# EAGLE schematic Fuel_Cell_Controller_may2022 (EAGLE 9.6.2)

## Sheet 1 of 9: MCU
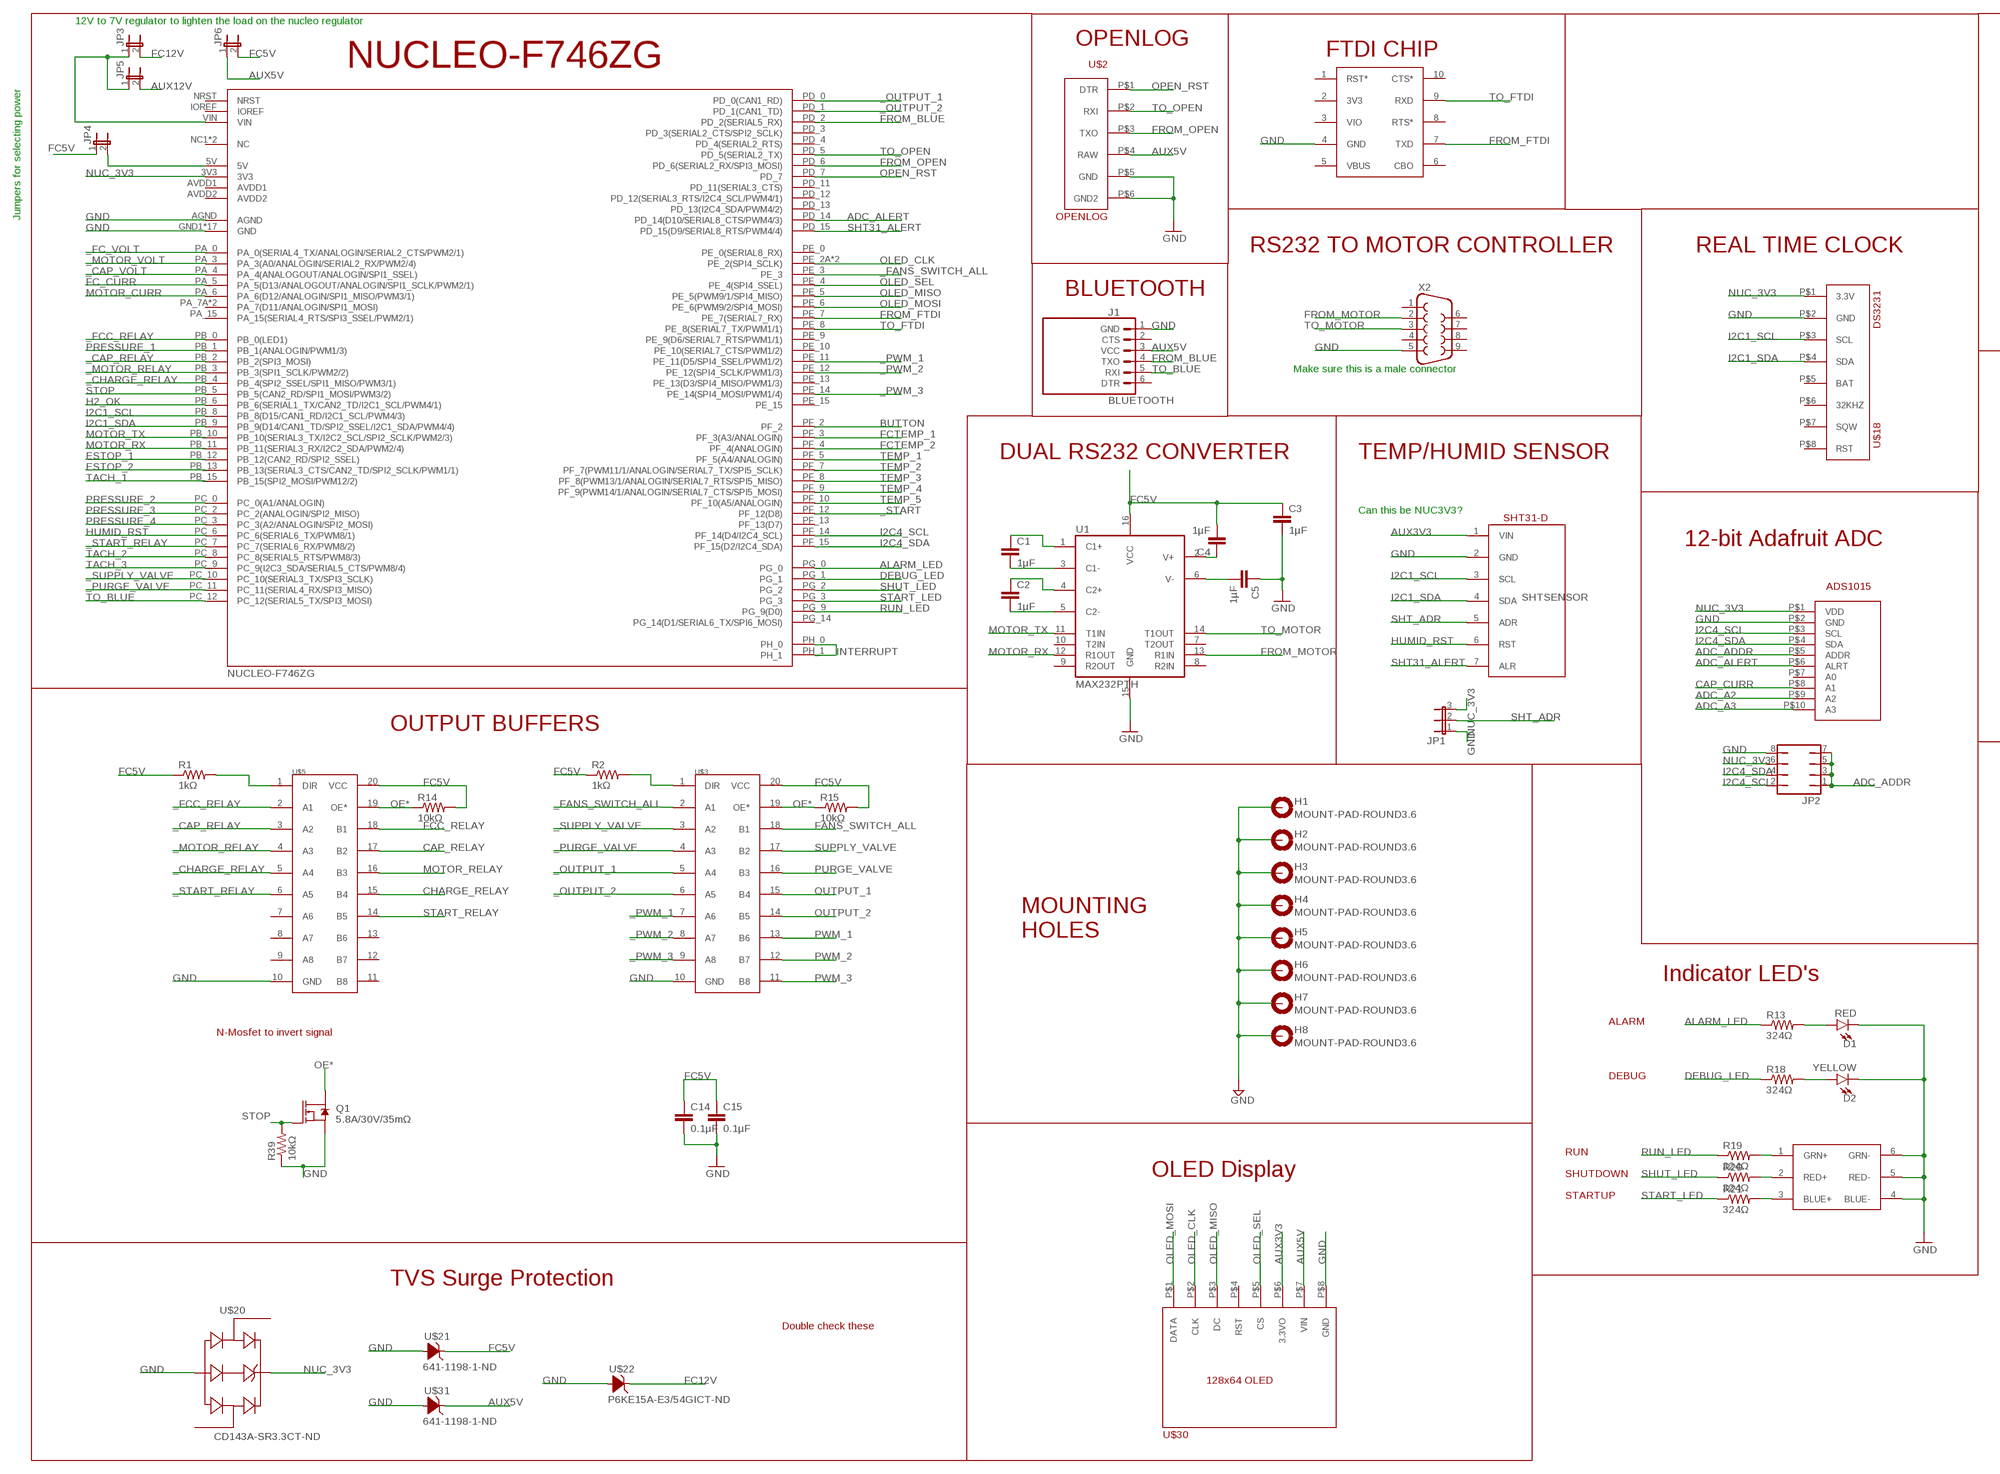
[diagram p0: schematic, sheet 1, part 1 of 2]
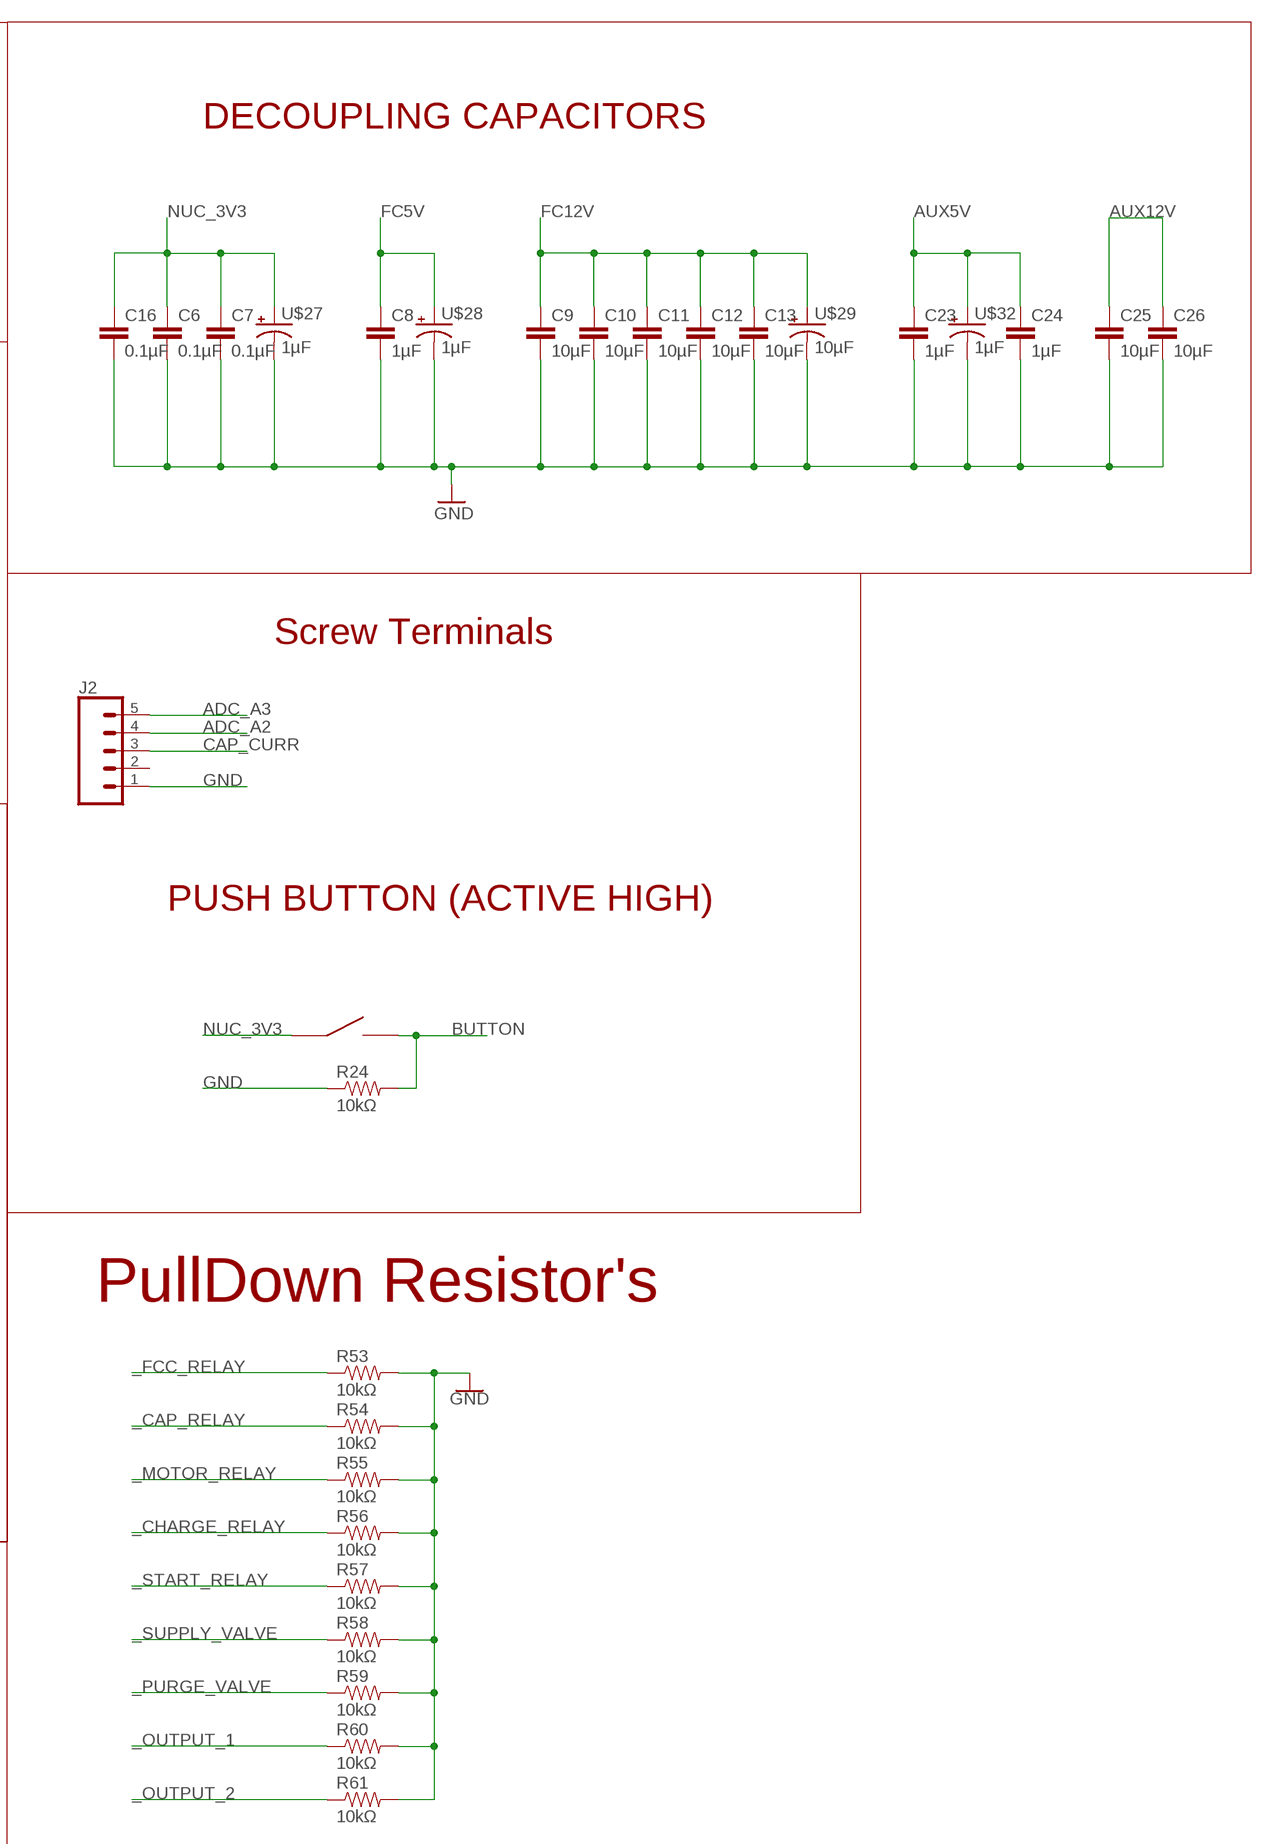
[diagram p1: schematic, sheet 1, part 2 of 2]

### Parts
C1  1µF  CAP0805  [0805]
C2  1µF  CAP0805  [0805]
C3  1µF  CAP0805  [0805]
C4  1µF  CAP0805  [0805]
C5  1µF  CAP0805  [0805]
C6  0.1µF  CAP0805  [0805]
C7  0.1µF  CAP0805  [0805]
C8  1µF  CAP0805  [0805]
C9  10µF  CAP0805  [0805]
C10  10µF  CAP0805  [0805]
C11  10µF  CAP0805  [0805]
C12  10µF  CAP0805  [0805]
C13  10µF  CAP0805  [0805]
C14  0.1µF  CAP0805  [0805]
C15  0.1µF  CAP0805  [0805]
C16  0.1µF  CAP0805  [0805]
C23  1µF  CAP0805  [0805]
C24  1µF  CAP0805  [0805]
C25  10µF  CAP0805  [0805]
C26  10µF  CAP0805  [0805]
D1  RED  LED1206  [LED-1206]
D2  YELLOW  LED1206  [LED-1206]
H1  MOUNT-PAD-ROUND3.6  [3,6-PAD]
H2  MOUNT-PAD-ROUND3.6  [3,6-PAD]
H3  MOUNT-PAD-ROUND3.6  [3,6-PAD]
H4  MOUNT-PAD-ROUND3.6  [3,6-PAD]
H5  MOUNT-PAD-ROUND3.6  [3,6-PAD]
H6  MOUNT-PAD-ROUND3.6  [3,6-PAD]
H7  MOUNT-PAD-ROUND3.6  [3,6-PAD]
H8  MOUNT-PAD-ROUND3.6  [3,6-PAD]
J1  BLUETOOTH  [1X06BLUETOOTH]
J2  CONN_05SCREW  [SCREWTERMINAL-3.5MM-5]
JP1  JP2E  [JP2]
JP2  JP4Q  [JP4Q]
JP3  JP1E  [JP1]
JP4  JP1E  [JP1]
JP5  JP1E  [JP1]
JP6  JP1E  [JP1]
Q1  5.8A/30V/35mΩ  MOSFET-NCH-AO3404A  [SOT23-3]
R1  1kΩ  RESISTOR0805-RES  [0805]
R2  1kΩ  RESISTOR0805-RES  [0805]
R13  324Ω  RESISTOR0805-RES  [0805]
R14  10kΩ  RESISTOR0805-RES  [0805]
R15  10kΩ  RESISTOR0805-RES  [0805]
R18  324Ω  RESISTOR0805-RES  [0805]
R19  324Ω  RESISTOR0805-RES  [0805]
R20  324Ω  RESISTOR0805-RES  [0805]
R21  324Ω  RESISTOR0805-RES  [0805]
R24  10kΩ  RESISTOR0805-RES  [0805]
R39  10kΩ  RESISTOR0805-RES  [0805]
R53  10kΩ  RESISTOR0805-RES  [0805]
R54  10kΩ  RESISTOR0805-RES  [0805]
R55  10kΩ  RESISTOR0805-RES  [0805]
R56  10kΩ  RESISTOR0805-RES  [0805]
R57  10kΩ  RESISTOR0805-RES  [0805]
R58  10kΩ  RESISTOR0805-RES  [0805]
R59  10kΩ  RESISTOR0805-RES  [0805]
R60  10kΩ  RESISTOR0805-RES  [0805]
R61  10kΩ  RESISTOR0805-RES  [0805]
SHTSENSOR  SHT31-DIS  [1X07-SHT31-DIS]
U1  MAX232PTH  [DIL16]
U$1  NUCLEO-F746ZGNUCLEO-F746ZG  [NUCLEO-F746ZG]
U$2  OPENLOG  [OPENLOG]
U$3  SN74LVC245AN  [DIL20]
U$5  SN74LVC245AN  [DIL20]
U$10  UMFT234XF  UMFT234XFUMFT234XF  [UMFT234XF]
U$18  DS3231  [DS3231]
U$19  ADS1015  [ADS1015]
U$20  CD143A-SR3.3CT-ND  [SOT143_AVAGO]
U$21  641-1198-1-ND  [SOT23]
U$22  P6KE15A-E3/54GICT-ND  [DO-204AC]
U$25  5060BRG45060BRG4  [5060BRG4]
U$26  EG4621CT-ND  [EG4621CT-ND]
U$27  1µF  CAP-VS-SERIES-PACKAGE-E(ELECT)VS-SERIES-PACKAGE-E  [PANASONIC_D]
U$28  1µF  CAP-VS-SERIES-PACKAGE-E(ELECT)VS-SERIES-PACKAGE-E  [PANASONIC_D]
U$29  10µF  CAP-VS-SERIES-PACKAGE-E(ELECT)VS-SERIES-PACKAGE-E  [PANASONIC_D]
U$30  ADAFRUITOLED  [1X08OLED]
U$31  641-1198-1-ND  [SOT23]
U$32  1µF  CAP-VS-SERIES-PACKAGE-E(ELECT)VS-SERIES-PACKAGE-E  [PANASONIC_D]
X2  F09HP  [F09HP]

### Nets
_CAP_RELAY: R54.1 U$1.PB_2(PB_2(SPI3_MOSI)) U$5.3(A2)
_CAP_VOLT: U$1.PA_4(PA_4(ANALOGOUT/ANALOGIN/SPI1_SSEL)) ; also sheet 9
_CHARGE_RELAY: R56.1 U$1.PB_4(PB_4(SPI2_SSEL/SPI1_MISO/PWM3/1)) U$5.5(A4)
_FANS_SWITCH_ALL: U$1.PE_3 U$3.2(A1)
_FC_VOLT: U$1.PA_0(PA_0(SERIAL4_TX/ANALOGIN/SERIAL2_CTS/PWM2/1)) ; also sheet 9
_FCC_RELAY: R53.1 U$1.PB_0(PB_0(LED1)) U$5.2(A1)
_MOTOR_RELAY: R55.1 U$1.PB_3(PB_3(SPI1_SCLK/PWM2/2)) U$5.4(A3)
_MOTOR_VOLT: U$1.PA_3(PA_3(A0/ANALOGIN/SERIAL2_RX/PWM2/4)) ; also sheet 9
_OUTPUT_1: R60.1 U$1.PD_0(PD_0(CAN1_RD)) U$3.5(A4)
_OUTPUT_2: R61.1 U$1.PD_1(PD_1(CAN1_TD)) U$3.6(A5)
_PURGE_VALVE: R59.1 U$1.PC_11(PC_11(SERIAL4_RX/SPI3_MISO)) U$3.4(A3)
_PWM_1: U$1.PE_11(PE_11(D5/SPI4_SSEL/PWM1/2)) U$3.7(A6)
_PWM_2: U$1.PE_12(PE_12(SPI4_SCLK/PWM1/3)) U$3.8(A7)
_PWM_3: U$1.PE_14(PE_14(SPI4_MOSI/PWM1/4)) U$3.9(A8)
_START: U$1.PF_12(PF_12(D8)) ; also sheet 2
_START_RELAY: R57.1 U$1.PC_7(PC_7(SERIAL6_RX/PWM8/2)) U$5.6(A5)
_SUPPLY_VALVE: R58.1 U$1.PC_10(PC_10(SERIAL3_TX/SPI3_SCLK)) U$3.3(A2)
ADC_A2: J2.4 U$19.P$9(A2)
ADC_A3: J2.5 U$19.P$10(A3)
ADC_ADDR: JP2.1 JP2.3 JP2.5 JP2.7 U$19.P$5(ADDR)
ADC_ALERT: U$1.PD_14(PD_14(D10/SERIAL8_CTS/PWM4/3)) U$19.P$6(ALRT)
ALARM_LED: R13.1 U$1.PG_0
AUX3V3: SHTSENSOR.1(VIN) U$30.P$6(3.3VO)
AUX5V: C23.1 C24.1 J1.3(VCC) JP6.1 U$2.P$4(RAW) U$30.P$7(VIN) U$31.C U$32.+ ; also sheet 6
AUX12V: C25.1 C26.1 JP5.2 ; also sheet 6,7
BUTTON: R24.2 U$1.PF_2 U$26.P$3 U$26.P$4
CAP_CURR: J2.3 U$19.P$8(A1) ; also sheet 9
CAP_RELAY: U$5.17(B2) ; also sheet 5
CHARGE_RELAY: U$5.15(B4) ; also sheet 5
DEBUG_LED: R18.1 U$1.PG_1
ESTOP_1: U$1.PB_12(PB_12(CAN2_RD/SPI2_SSEL)) ; also sheet 2
ESTOP_2: U$1.PB_13(PB_13(SERIAL3_CTS/CAN2_TD/SPI2_SCLK/PWM1/1)) ; also sheet 2
FANS_SWITCH_ALL: U$3.18(B1) ; also sheet 8
FC5V: C3.1 C4.2 C8.1 C14.1 C15.1 JP4.1 JP6.2 R1.1 R2.1 R14.2 R15.2 U1.16(VCC) U$3.20(VCC) U$5.20(VCC) U$21.C U$28.+ ; also sheet 6,9
FC12V: C9.1 C10.1 C11.1 C12.1 C13.1 JP3.2 U$22.CATHODE(C) U$29.+ ; also sheet 3,6,7,8
FC_CURR: U$1.PA_5(PA_5(D13/ANALOGOUT/ANALOGIN/SPI1_SCLK/PWM2/1)) ; also sheet 9
FCC_RELAY: U$5.18(B1) ; also sheet 5
FCTEMP_1: U$1.PF_3(PF_3(A3/ANALOGIN)) ; also sheet 4
FCTEMP_2: U$1.PF_4(PF_4(ANALOGIN)) ; also sheet 4
FROM_BLUE: J1.4(TXO) U$1.PD_2(PD_2(SERIAL5_RX))
FROM_FTDI: U$1.PE_7(PE_7(SERIAL7_RX)) U$10.7(TXD)
FROM_MOTOR: U1.13(R1IN) X2.2
FROM_OPEN: U$1.PD_6(PD_6(SERIAL2_RX/SPI3_MOSI)) U$2.P$3(TXO)
GND: C3.2 C5.1 C6.2 C7.2 C8.2 C9.2 C10.2 C11.2 C12.2 C13.2 C14.2 C15.2 C16.2 C23.2 C24.2 C25.2 C26.2 D1.C D2.C H1.B3,6(MOUNT) H2.B3,6(MOUNT) H3.B3,6(MOUNT) H4.B3,6(MOUNT) H5.B3,6(MOUNT) H6.B3,6(MOUNT) H7.B3,6(MOUNT) H8.B3,6(MOUNT) J1.1(GND) J2.1 JP1.1 JP2.8 Q1.2(S) R24.1 R39.1 R53.2 R54.2 R55.2 R56.2 R57.2 R58.2 R59.2 R60.2 R61.2 SHTSENSOR.2(GND) U1.15(GND) U$1.AGND U$1.GND1(GND) U$1.GND2(GND) U$1.GND3(GND) U$1.GND4(GND) U$1.GND5(GND) U$1.GND6(GND) U$1.GND7(GND) U$1.GND8(GND) U$1.GND9(GND) U$1.GND10(GND) U$1.GND11(GND) U$1.GND12(GND) U$1.GND13(GND) U$1.GND14(GND) U$1.GND15(GND) U$1.GND16(GND) U$1.GND17(GND) U$2.P$5(GND) U$2.P$6(GND2) U$3.10(GND) U$5.10(GND) U$10.4(GND) U$18.P$2(GND) U$19.P$2(GND) U$20.GND U$21.A1(A) U$21.A2(A) U$22.ANODE(A) U$25.4(BLUE-) U$25.5(RED-) U$25.6(GRN-) U$27.- U$28.- U$29.- U$30.P$8(GND) U$31.A1(A) U$31.A2(A) U$32.- X2.5 ; also sheet 2,3,4,5,6,7,8,9
H2_OK: U$1.PB_6(PB_6(SERIAL1_TX/CAN2_TD/I2C1_SCL/PWM4/1)) ; also sheet 2
HUMID_RST: SHTSENSOR.6(RST) U$1.PC_6(PC_6(SERIAL6_TX/PWM8/1))
I2C1_SCL: SHTSENSOR.3(SCL) U$1.PB_8(PB_8(D15/CAN1_RD/I2C1_SCL/PWM4/3)) U$18.P$3(SCL)
I2C1_SDA: SHTSENSOR.4(SDA) U$1.PB_9(PB_9(D14/CAN1_TD/SPI2_SSEL/I2C1_SDA/PWM4/4)) U$18.P$4(SDA)
I2C4_SCL: JP2.2 U$1.PF_14(PF_14(D4/I2C4_SCL)) U$19.P$3(SCL)
I2C4_SDA: JP2.4 U$1.PF_15(PF_15(D2/I2C4_SDA)) U$19.P$4(SDA)
INTERRUPT: U$1.PH_0 U$1.PH_1
MOTOR_CURR: U$1.PA_6(PA_6(D12/ANALOGIN/SPI1_MISO/PWM3/1)) ; also sheet 9
MOTOR_RELAY: U$5.16(B3) ; also sheet 5
MOTOR_RX: U1.12(R1OUT) U$1.PB_11(PB_11(SERIAL3_RX/I2C2_SDA/PWM2/4))
MOTOR_TX: U1.11(T1IN) U$1.PB_10(PB_10(SERIAL3_TX/I2C2_SCL/SPI2_SCLK/PWM2/3))
N$1: JP4.2 U$1.5V
N$3: C1.1 U1.1(C1+)
N$4: C1.2 U1.3(C1-)
N$5: C2.1 U1.4(C2+)
N$6: C2.2 U1.5(C2-)
N$7: C4.1 U1.2(V+)
N$8: C5.2 U1.6(V-)
N$10: R2.2 U$3.1(DIR)
N$11: R1.2 U$5.1(DIR)
N$16: D1.A R13.2
N$17: D2.A R18.2
N$18: R19.2 U$25.1(GRN+)
N$19: R20.2 U$25.2(RED+)
N$20: R21.2 U$25.3(BLUE+)
NUC_3V3: C6.1 C7.1 C16.1 JP1.3 JP2.6 U$1.3V3 U$18.P$1(3.3V) U$19.P$1(VDD) U$20.VDD U$26.P$1 U$26.P$2 U$27.+ ; also sheet 2,4
OE*: Q1.3(D) R14.1 R15.1 U$3.19(OE*) U$5.19(OE*)
OLED_CLK: U$1.PE_2A(PE_2(SPI4_SCLK)) U$1.PE_2B(PE_2(SPI4_SCLK)) U$30.P$2(CLK)
OLED_MISO: U$1.PE_5(PE_5(PWM9/1/SPI4_MISO)) U$30.P$3(DC)
OLED_MOSI: U$1.PE_6(PE_6(PWM9/2/SPI4_MOSI)) U$30.P$1(DATA)
OLED_SEL: U$1.PE_4(PE_4(SPI4_SSEL)) U$30.P$5(CS)
OPEN_RST: U$1.PD_7 U$2.P$1(DTR)
OUTPUT_1: U$3.15(B4) ; also sheet 7
OUTPUT_2: U$3.14(B5) ; also sheet 7
PRESSURE_1: U$1.PB_1(PB_1(ANALOGIN/PWM1/3)) ; also sheet 3
PRESSURE_2: U$1.PC_0(PC_0(A1/ANALOGIN)) ; also sheet 3
PRESSURE_3: U$1.PC_2(PC_2(ANALOGIN/SPI2_MISO)) ; also sheet 3
PRESSURE_4: U$1.PC_3(PC_3(A2/ANALOGIN/SPI2_MOSI)) ; also sheet 3
PURGE_VALVE: U$3.16(B3) ; also sheet 7
PWM_1: U$3.13(B6) ; also sheet 2
PWM_2: U$3.12(B7) ; also sheet 2
PWM_3: U$3.11(B8) ; also sheet 2
RUN_LED: R19.1 U$1.PG_9(PG_9(D0))
SHT31_ALERT: SHTSENSOR.7(ALR) U$1.PD_15(PD_15(D9/SERIAL8_RTS/PWM4/4))
SHT_ADR: JP1.2 SHTSENSOR.5(ADR)
SHUT_LED: R20.1 U$1.PG_2
START_LED: R21.1 U$1.PG_3
START_RELAY: U$5.14(B5) ; also sheet 5
STOP: Q1.1(G) R39.2 U$1.PB_5(PB_5(CAN2_RD/SPI1_MOSI/PWM3/2)) ; also sheet 2
SUPPLY_VALVE: U$3.17(B2) ; also sheet 7
TACH_1: U$1.PB_15(PB_15(SPI2_MOSI/PWM12/2)) ; also sheet 2
TACH_2: U$1.PC_8(PC_8(SERIAL5_RTS/PWM8/3)) ; also sheet 2
TACH_3: U$1.PC_9(PC_9(I2C3_SDA/SERIAL5_CTS/PWM8/4)) ; also sheet 2
TEMP_1: U$1.PF_5(PF_5(A4/ANALOGIN)) ; also sheet 4
TEMP_2: U$1.PF_7(PF_7(PWM11/1/ANALOGIN/SERIAL7_TX/SPI5_SCLK)) ; also sheet 4
TEMP_3: U$1.PF_8(PF_8(PWM13/1/ANALOGIN/SERIAL7_RTS/SPI5_MISO)) ; also sheet 4
TEMP_4: U$1.PF_9(PF_9(PWM14/1/ANALOGIN/SERIAL7_CTS/SPI5_MOSI)) ; also sheet 4
TEMP_5: U$1.PF_10(PF_10(A5/ANALOGIN)) ; also sheet 4
TO_BLUE: J1.5(RXI) U$1.PC_12(PC_12(SERIAL5_TX/SPI3_MOSI))
TO_FTDI: U$1.PE_8(PE_8(SERIAL7_TX/PWM1/1)) U$10.9(RXD)
TO_MOTOR: U1.14(T1OUT) X2.3
TO_OPEN: U$1.PD_5(PD_5(SERIAL2_TX)) U$2.P$2(RXI)
VIN: JP3.1 JP5.1 U$1.VIN
Unconnected: J1.2(CTS) J1.6(DTR) J2.2 U1.7(T2OUT) U1.8(R2IN) U1.9(R2OUT) U1.10(T2IN) U$1.AVDD1 U$1.AVDD2 U$1.IOREF U$1.NC1(NC) U$1.NC2(NC) U$1.NRST U$1.PA_7A(PA_7(D11/ANALOGIN/SPI1_MOSI)) U$1.PA_7B(PA_7(D11/ANALOGIN/SPI1_MOSI)) U$1.PA_15(PA_15(SERIAL4_RTS/SPI3_SSEL/PWM2/1)) U$1.PD_3(PD_3(SERIAL2_CTS/SPI2_SCLK)) U$1.PD_4(PD_4(SERIAL2_RTS)) U$1.PD_11(PD_11(SERIAL3_CTS)) U$1.PD_12(PD_12(SERIAL3_RTS/I2C4_SCL/PWM4/1)) U$1.PD_13(PD_13(I2C4_SDA/PWM4/2)) U$1.PE_0(PE_0(SERIAL8_RX)) U$1.PE_9(PE_9(D6/SERIAL7_RTS/PWM1/1)) U$1.PE_10(PE_10(SERIAL7_CTS/PWM1/2)) U$1.PE_13(PE_13(D3/SPI4_MISO/PWM1/3)) U$1.PE_15 U$1.PF_13(PF_13(D7)) U$1.PG_14(PG_14(D1/SERIAL6_TX/SPI6_MOSI)) U$5.7(A6) U$5.8(A7) U$5.9(A8) U$5.11(B8) U$5.12(B7) U$5.13(B6) U$10.1(RST*) U$10.2(3V3) U$10.3(VIO) U$10.5(VBUS) U$10.6(CBO) U$10.8(RTS*) U$10.10(CTS*) U$18.P$5(BAT) U$18.P$6(32KHZ) U$18.P$7(SQW) U$18.P$8(RST) U$19.P$7(A0) U$20.IO1 U$20.IO3 U$30.P$4(RST) X2.1 X2.4 X2.6 X2.7 X2.8 X2.9

### Notes on the sheet
- 12V to 7V regulator to lighten the load on the nucleo regulator
- OPENLOG
- FTDI CHIP
- NUCLEO-F746ZG
- DECOUPLING CAPACITORS
- Jumpers for selecting power
- RS232 TO MOTOR CONTROLLER | REAL TIME CLOCK
- BLUETOOTH
- Make sure this is a male connector
- Screw Terminals
- DUAL RS232 CONVERTER | TEMP/HUMID SENSOR
- Can this be NUC3V3?
- 12-bit Adafruit ADC
- PUSH BUTTON (ACTIVE HIGH)
- OUTPUT BUFFERS
- PullDown Resistor's
- MOUNTING
  HOLES
- Indicator LED's
- ALARM
- N-Mosfet to invert signal
- DEBUG
- RUN
- OLED Display | SHUTDOWN
- STARTUP
- TVS Surge Protection
- Double check these

## Sheet 2 of 9: Ethernet I/O
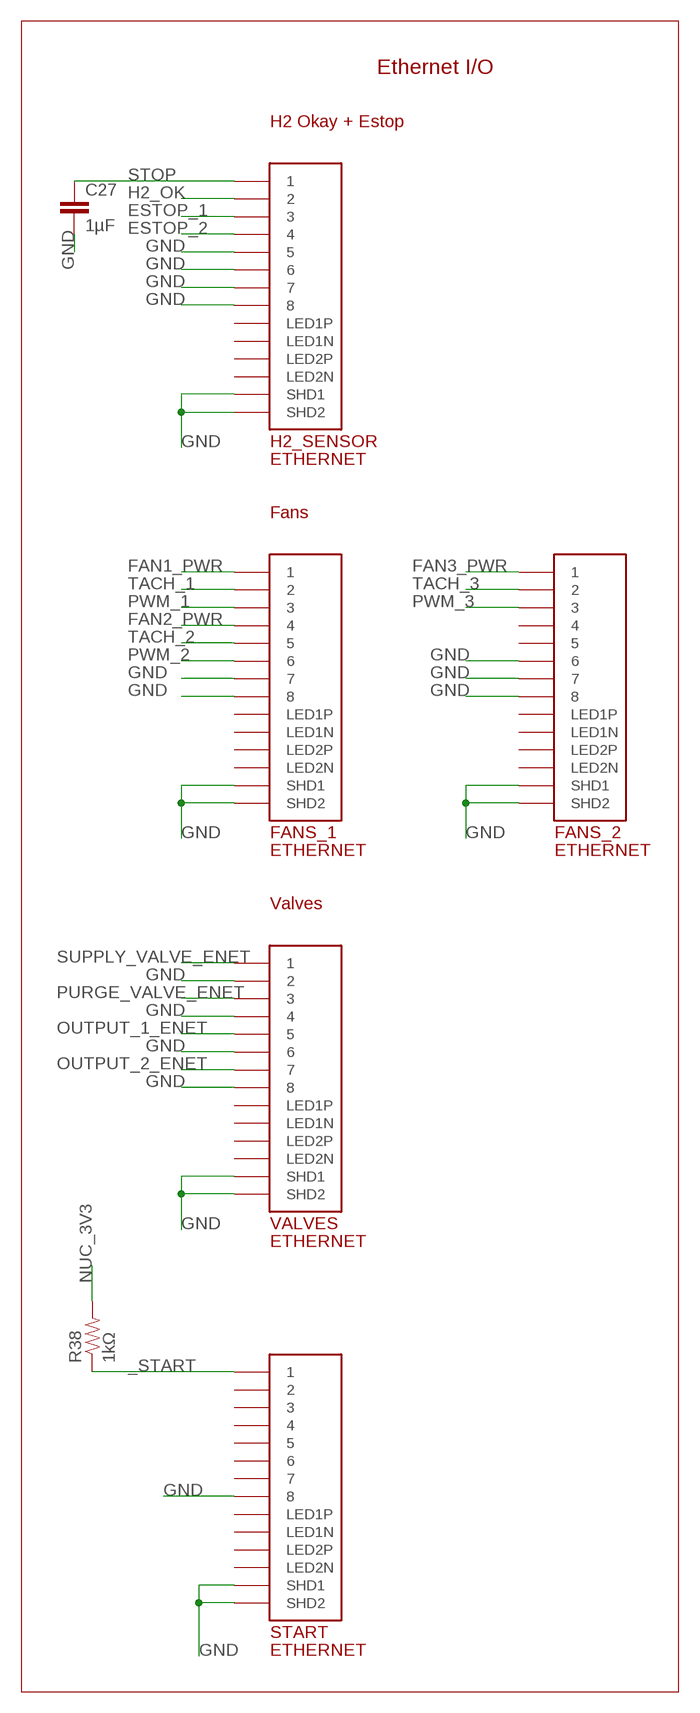
[diagram p2: schematic, sheet 2]

### Parts
C27  1µF  CAP0805  [0805]
FANS_1  ETHERNET  [A122645-ND]
FANS_2  ETHERNET  [A122645-ND]
H2_SENSOR  ETHERNET  [A122645-ND]
R38  1kΩ  RESISTOR0805-RES  [0805]
START  ETHERNET  [A122645-ND]
VALVES  ETHERNET  [A122645-ND]

### Nets
_START: R38.1 START.P$1 ; also sheet 1
ESTOP_1: H2_SENSOR.P$3 ; also sheet 1
ESTOP_2: H2_SENSOR.P$4 ; also sheet 1
FAN1_PWR: FANS_1.P$1 ; also sheet 8
FAN2_PWR: FANS_1.P$4 ; also sheet 8
FAN3_PWR: FANS_2.P$1 ; also sheet 8
GND: C27.2 FANS_1.P$7 FANS_1.P$8 FANS_1.P$13(SHD1) FANS_1.P$14(SHD2) FANS_2.P$6 FANS_2.P$7 FANS_2.P$8 FANS_2.P$13(SHD1) FANS_2.P$14(SHD2) H2_SENSOR.P$5 H2_SENSOR.P$6 H2_SENSOR.P$7 H2_SENSOR.P$8 H2_SENSOR.P$13(SHD1) H2_SENSOR.P$14(SHD2) START.P$8 START.P$13(SHD1) START.P$14(SHD2) VALVES.P$2 VALVES.P$4 VALVES.P$6 VALVES.P$8 VALVES.P$13(SHD1) VALVES.P$14(SHD2) ; also sheet 1,3,4,5,6,7,8,9
H2_OK: H2_SENSOR.P$2 ; also sheet 1
NUC_3V3: R38.2 ; also sheet 1,4
OUTPUT_1_ENET: VALVES.P$5 ; also sheet 7
OUTPUT_2_ENET: VALVES.P$7 ; also sheet 7
PURGE_VALVE_ENET: VALVES.P$3 ; also sheet 7
PWM_1: FANS_1.P$3 ; also sheet 1
PWM_2: FANS_1.P$6 ; also sheet 1
PWM_3: FANS_2.P$3 ; also sheet 1
STOP: C27.1 H2_SENSOR.P$1 ; also sheet 1
SUPPLY_VALVE_ENET: VALVES.P$1 ; also sheet 7
TACH_1: FANS_1.P$2 ; also sheet 1
TACH_2: FANS_1.P$5 ; also sheet 1
TACH_3: FANS_2.P$2 ; also sheet 1
Unconnected: FANS_1.P$9(LED1N) FANS_1.P$10(LED1P) FANS_1.P$11(LED2N) FANS_1.P$12(LED2P) FANS_2.P$4 FANS_2.P$5 FANS_2.P$9(LED1N) FANS_2.P$10(LED1P) FANS_2.P$11(LED2N) FANS_2.P$12(LED2P) H2_SENSOR.P$9(LED1N) H2_SENSOR.P$10(LED1P) H2_SENSOR.P$11(LED2N) H2_SENSOR.P$12(LED2P) START.P$2 START.P$3 START.P$4 START.P$5 START.P$6 START.P$7 START.P$9(LED1N) START.P$10(LED1P) START.P$11(LED2N) START.P$12(LED2P) VALVES.P$9(LED1N) VALVES.P$10(LED1P) VALVES.P$11(LED2N) VALVES.P$12(LED2P)

### Notes on the sheet
- Ethernet I/O
- H2 Okay + Estop
- Fans
- Valves

## Sheet 3 of 9
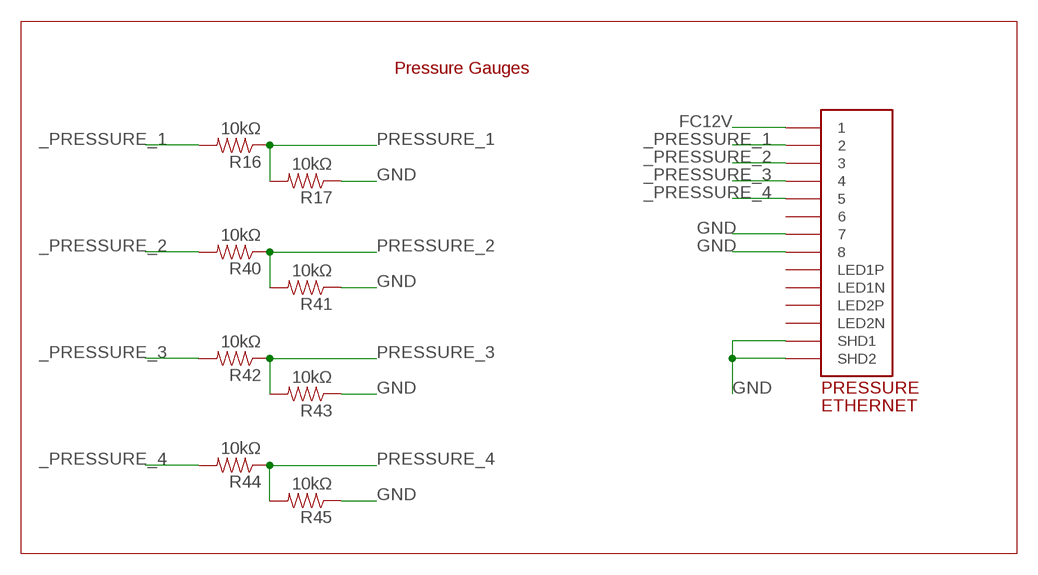
[diagram p3: schematic, sheet 3]

### Parts
PRESSURE  ETHERNET  [A122645-ND]
R16  10kΩ  RESISTOR0805-RES  [0805]
R17  10kΩ  RESISTOR0805-RES  [0805]
R40  10kΩ  RESISTOR0805-RES  [0805]
R41  10kΩ  RESISTOR0805-RES  [0805]
R42  10kΩ  RESISTOR0805-RES  [0805]
R43  10kΩ  RESISTOR0805-RES  [0805]
R44  10kΩ  RESISTOR0805-RES  [0805]
R45  10kΩ  RESISTOR0805-RES  [0805]

### Nets
_PRESSURE_1: PRESSURE.P$2 R16.2
_PRESSURE_2: PRESSURE.P$3 R40.2
_PRESSURE_3: PRESSURE.P$4 R42.2
_PRESSURE_4: PRESSURE.P$5 R44.2
FC12V: PRESSURE.P$1 ; also sheet 1,6,7,8
GND: PRESSURE.P$7 PRESSURE.P$8 PRESSURE.P$13(SHD1) PRESSURE.P$14(SHD2) R17.1 R41.1 R43.1 R45.1 ; also sheet 1,2,4,5,6,7,8,9
PRESSURE_1: R16.1 R17.2 ; also sheet 1
PRESSURE_2: R40.1 R41.2 ; also sheet 1
PRESSURE_3: R42.1 R43.2 ; also sheet 1
PRESSURE_4: R44.1 R45.2 ; also sheet 1
Unconnected: PRESSURE.P$6 PRESSURE.P$9(LED1N) PRESSURE.P$10(LED1P) PRESSURE.P$11(LED2N) PRESSURE.P$12(LED2P)

### Notes on the sheet
- Pressure Gauges

## Sheet 4 of 9
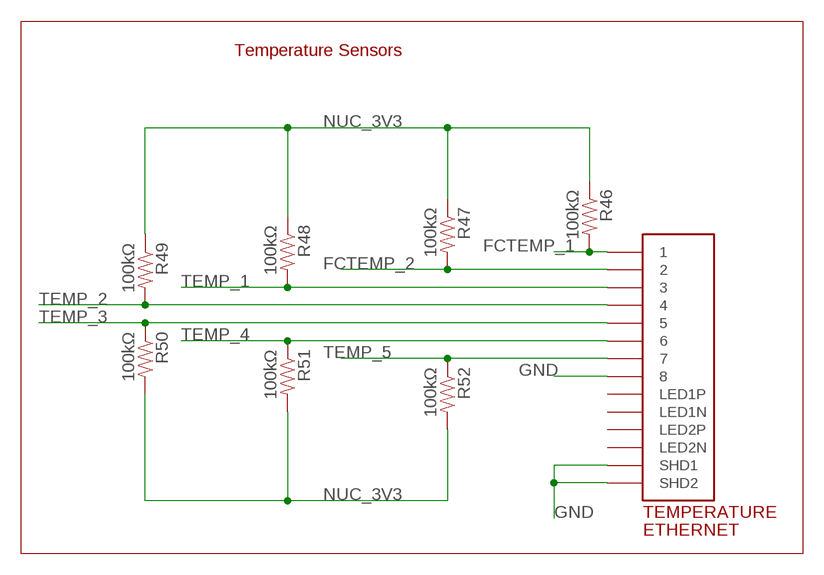
[diagram p4: schematic, sheet 4]

### Parts
R46  100kΩ  RESISTOR0805-RES  [0805]
R47  100kΩ  RESISTOR0805-RES  [0805]
R48  100kΩ  RESISTOR0805-RES  [0805]
R49  100kΩ  RESISTOR0805-RES  [0805]
R50  100kΩ  RESISTOR0805-RES  [0805]
R51  100kΩ  RESISTOR0805-RES  [0805]
R52  100kΩ  RESISTOR0805-RES  [0805]
TEMPERATURE  ETHERNET  [A122645-ND]

### Nets
FCTEMP_1: R46.2 TEMPERATURE.P$1 ; also sheet 1
FCTEMP_2: R47.2 TEMPERATURE.P$2 ; also sheet 1
GND: TEMPERATURE.P$8 TEMPERATURE.P$13(SHD1) TEMPERATURE.P$14(SHD2) ; also sheet 1,2,3,5,6,7,8,9
NUC_3V3: R46.1 R47.1 R48.1 R49.1 R50.2 R51.2 R52.2 ; also sheet 1,2
TEMP_1: R48.2 TEMPERATURE.P$3 ; also sheet 1
TEMP_2: R49.2 TEMPERATURE.P$4 ; also sheet 1
TEMP_3: R50.1 TEMPERATURE.P$5 ; also sheet 1
TEMP_4: R51.1 TEMPERATURE.P$6 ; also sheet 1
TEMP_5: R52.1 TEMPERATURE.P$7 ; also sheet 1
Unconnected: TEMPERATURE.P$9(LED1N) TEMPERATURE.P$10(LED1P) TEMPERATURE.P$11(LED2N) TEMPERATURE.P$12(LED2P)

### Notes on the sheet
- Temperature Sensors

## Sheet 5 of 9: RELAY BOARD Ethernet
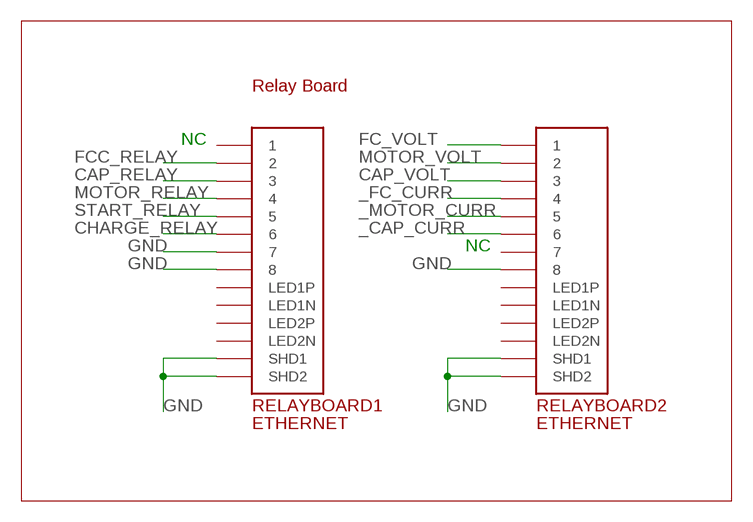
[diagram p5: schematic, sheet 5]

### Parts
RELAYBOARD1  ETHERNET  [A122645-ND]
RELAYBOARD2  ETHERNET  [A122645-ND]

### Nets
_CAP_CURR: RELAYBOARD2.P$6 ; also sheet 9
_FC_CURR: RELAYBOARD2.P$4 ; also sheet 9
_MOTOR_CURR: RELAYBOARD2.P$5 ; also sheet 9
CAP_RELAY: RELAYBOARD1.P$3 ; also sheet 1
CAP_VOLT: RELAYBOARD2.P$3 ; also sheet 9
CHARGE_RELAY: RELAYBOARD1.P$6 ; also sheet 1
FC_VOLT: RELAYBOARD2.P$1 ; also sheet 9
FCC_RELAY: RELAYBOARD1.P$2 ; also sheet 1
GND: RELAYBOARD1.P$7 RELAYBOARD1.P$8 RELAYBOARD1.P$13(SHD1) RELAYBOARD1.P$14(SHD2) RELAYBOARD2.P$8 RELAYBOARD2.P$13(SHD1) RELAYBOARD2.P$14(SHD2) ; also sheet 1,2,3,4,6,7,8,9
MOTOR_RELAY: RELAYBOARD1.P$4 ; also sheet 1
MOTOR_VOLT: RELAYBOARD2.P$2 ; also sheet 9
START_RELAY: RELAYBOARD1.P$5 ; also sheet 1
Unconnected: RELAYBOARD1.P$1 RELAYBOARD1.P$9(LED1N) RELAYBOARD1.P$10(LED1P) RELAYBOARD1.P$11(LED2N) RELAYBOARD1.P$12(LED2P) RELAYBOARD2.P$7 RELAYBOARD2.P$9(LED1N) RELAYBOARD2.P$10(LED1P) RELAYBOARD2.P$11(LED2N) RELAYBOARD2.P$12(LED2P)

### Notes on the sheet
- Relay Board
- NC
- NC

## Sheet 6 of 9: POWER Inputs
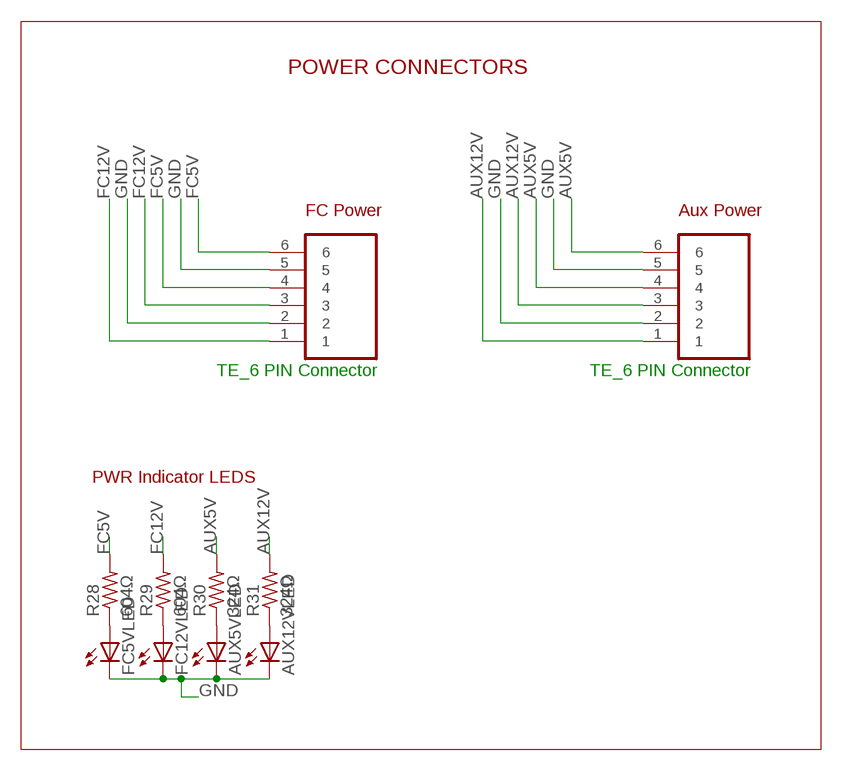
[diagram p6: schematic, sheet 6]

### Parts
AUX5VLED  LEDCHIP-LED0805  [CHIP-LED0805]
AUX12VLED  LEDCHIP-LED0805  [CHIP-LED0805]
AUX_PWR  TE_6-PIN  [TE_6-PIN]
FC5VLED  LEDCHIP-LED0805  [CHIP-LED0805]
FC12VLED  LEDCHIP-LED0805  [CHIP-LED0805]
FC_PWR  TE_6-PIN  [TE_6-PIN]
R28  604Ω  R-US_R0805  [R0805]
R29  604Ω  R-US_R0805  [R0805]
R30  324Ω  R-US_R0805  [R0805]
R31  324Ω  R-US_R0805  [R0805]

### Nets
AUX5V: AUX_PWR.4 AUX_PWR.6 R30.2 ; also sheet 1
AUX12V: AUX_PWR.1 AUX_PWR.3 R31.2 ; also sheet 1,7
FC5V: FC_PWR.4 FC_PWR.6 R28.2 ; also sheet 1,9
FC12V: FC_PWR.1 FC_PWR.3 R29.2 ; also sheet 1,3,7,8
GND: AUX5VLED.C AUX12VLED.C AUX_PWR.2 AUX_PWR.5 FC5VLED.C FC12VLED.C FC_PWR.2 FC_PWR.5 ; also sheet 1,2,3,4,5,7,8,9
N$21: FC5VLED.A R28.1
N$23: FC12VLED.A R29.1
N$25: AUX5VLED.A R30.1
N$28: AUX12VLED.A R31.1

### Notes on the sheet
- POWER CONNECTORS
- FC Power | Aux Power
- TE_6 PIN Connector | TE_6 PIN Connector
- PWR Indicator LEDS

## Sheet 7 of 9: VALVES
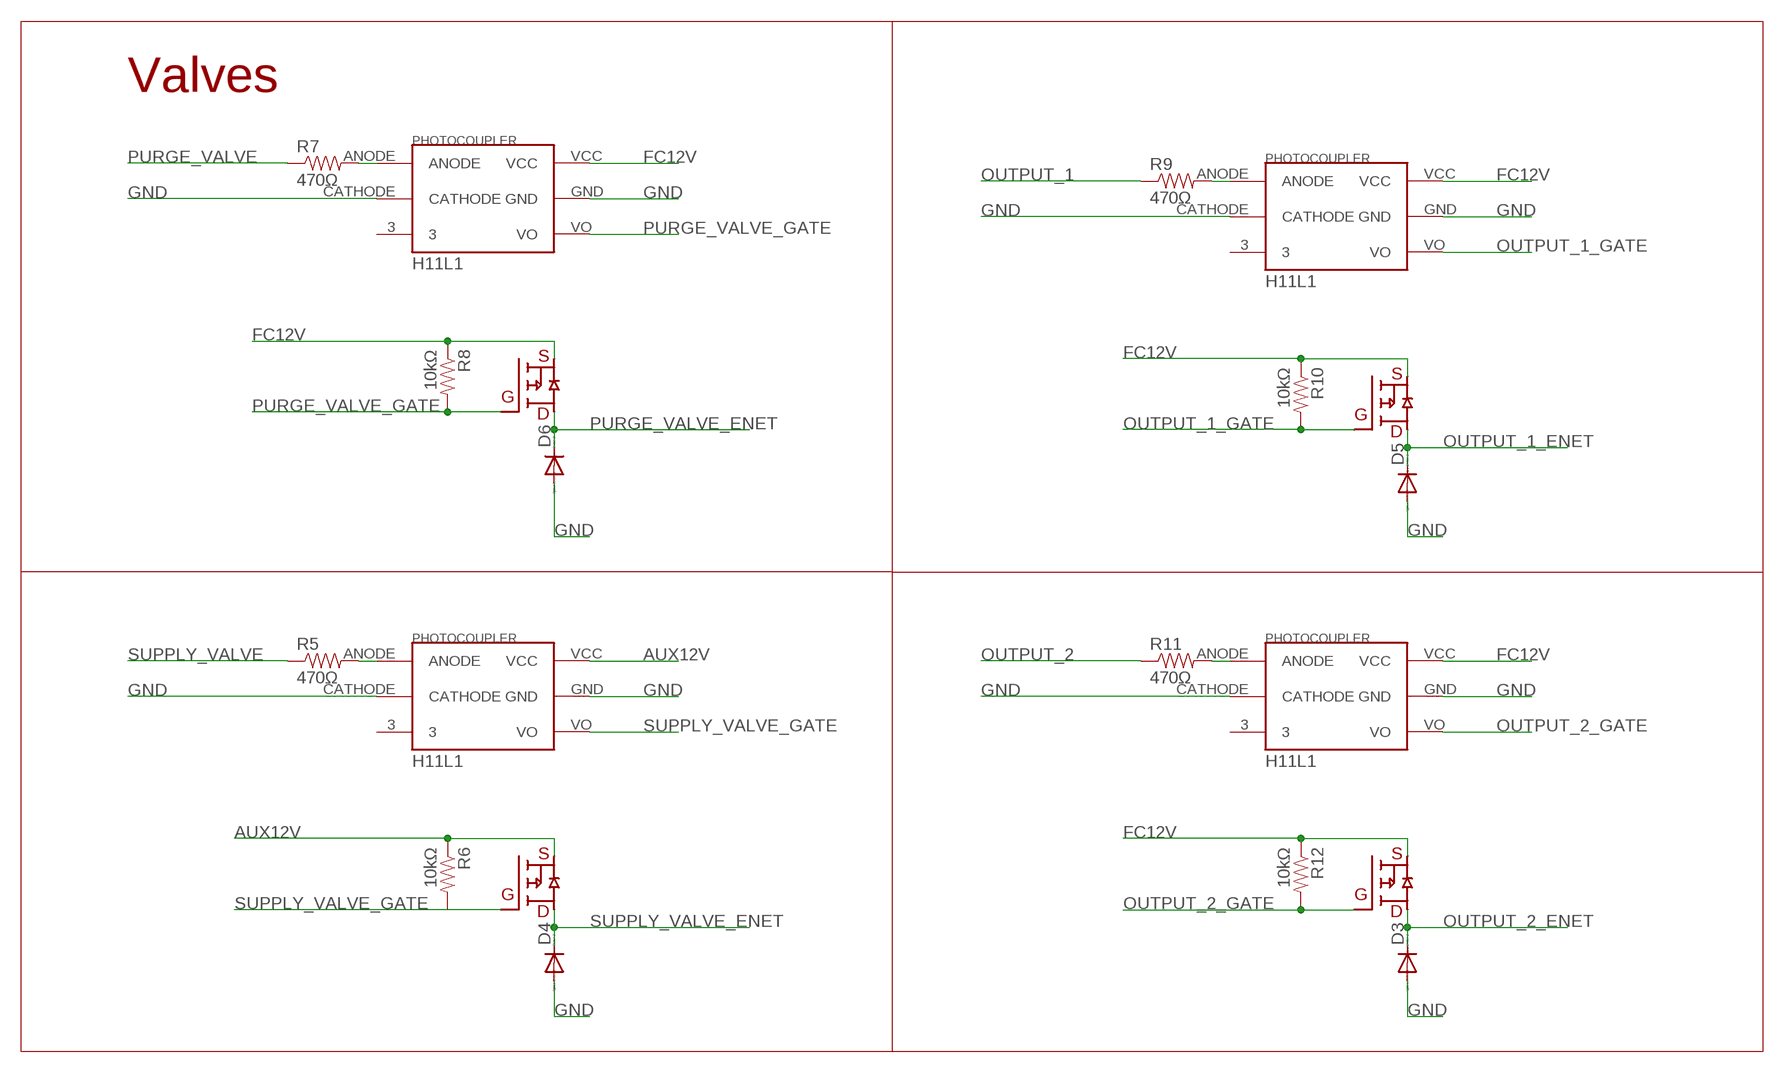
[diagram p7: schematic, sheet 7]

### Parts
D3  DIODE-DO214AC  [DO214AC]
D4  DIODE-DO214AC  [DO214AC]
D5  DIODE-DO214AC  [DO214AC]
D6  DIODE-DO214AC  [DO214AC]
R5  470Ω  RESISTOR0805-RES  [0805]
R6  10kΩ  RESISTOR0805-RES  [0805]
R7  470Ω  RESISTOR0805-RES  [0805]
R8  10kΩ  RESISTOR0805-RES  [0805]
R9  470Ω  RESISTOR0805-RES  [0805]
R10  10kΩ  RESISTOR0805-RES  [0805]
R11  470Ω  RESISTOR0805-RES  [0805]
R12  10kΩ  RESISTOR0805-RES  [0805]
U$6  H11L1H11L1  [H11L1]
U$11  H11L1H11L1  [H11L1]
U$12  DMP3056L-7DMP3056L-7  [DMP3056L-7]
U$13  DMP3056L-7DMP3056L-7  [DMP3056L-7]
U$14  H11L1H11L1  [H11L1]
U$15  DMP3056L-7DMP3056L-7  [DMP3056L-7]
U$16  H11L1H11L1  [H11L1]
U$17  DMP3056L-7DMP3056L-7  [DMP3056L-7]

### Nets
AUX12V: R6.1 U$6.VCC U$12.S(SOURCE) ; also sheet 1,6
FC12V: R8.1 R10.1 R12.1 U$11.VCC U$13.S(SOURCE) U$14.VCC U$15.S(SOURCE) U$16.VCC U$17.S(SOURCE) ; also sheet 1,3,6,8
GND: D3.A D4.A D5.A D6.A U$6.CATHODE U$6.GND U$11.CATHODE U$11.GND U$14.CATHODE U$14.GND U$16.CATHODE U$16.GND ; also sheet 1,2,3,4,5,6,8,9
N$2: R5.2 U$6.ANODE
N$9: R7.2 U$11.ANODE
N$13: R9.2 U$14.ANODE
N$14: R11.2 U$16.ANODE
OUTPUT_1: R9.1 ; also sheet 1
OUTPUT_1_ENET: D5.C U$15.D(DRAIN) ; also sheet 2
OUTPUT_1_GATE: R10.2 U$14.VO U$15.G(GATE)
OUTPUT_2: R11.1 ; also sheet 1
OUTPUT_2_ENET: D3.C U$17.D(DRAIN) ; also sheet 2
OUTPUT_2_GATE: R12.2 U$16.VO U$17.G(GATE)
PURGE_VALVE: R7.1 ; also sheet 1
PURGE_VALVE_ENET: D6.C U$13.D(DRAIN) ; also sheet 2
PURGE_VALVE_GATE: R8.2 U$11.VO U$13.G(GATE)
SUPPLY_VALVE: R5.1 ; also sheet 1
SUPPLY_VALVE_ENET: D4.C U$12.D(DRAIN) ; also sheet 2
SUPPLY_VALVE_GATE: R6.2 U$6.VO U$12.G(GATE)
Unconnected: U$6.3 U$11.3 U$14.3 U$16.3

### Notes on the sheet
- Valves

## Sheet 8 of 9: Fans
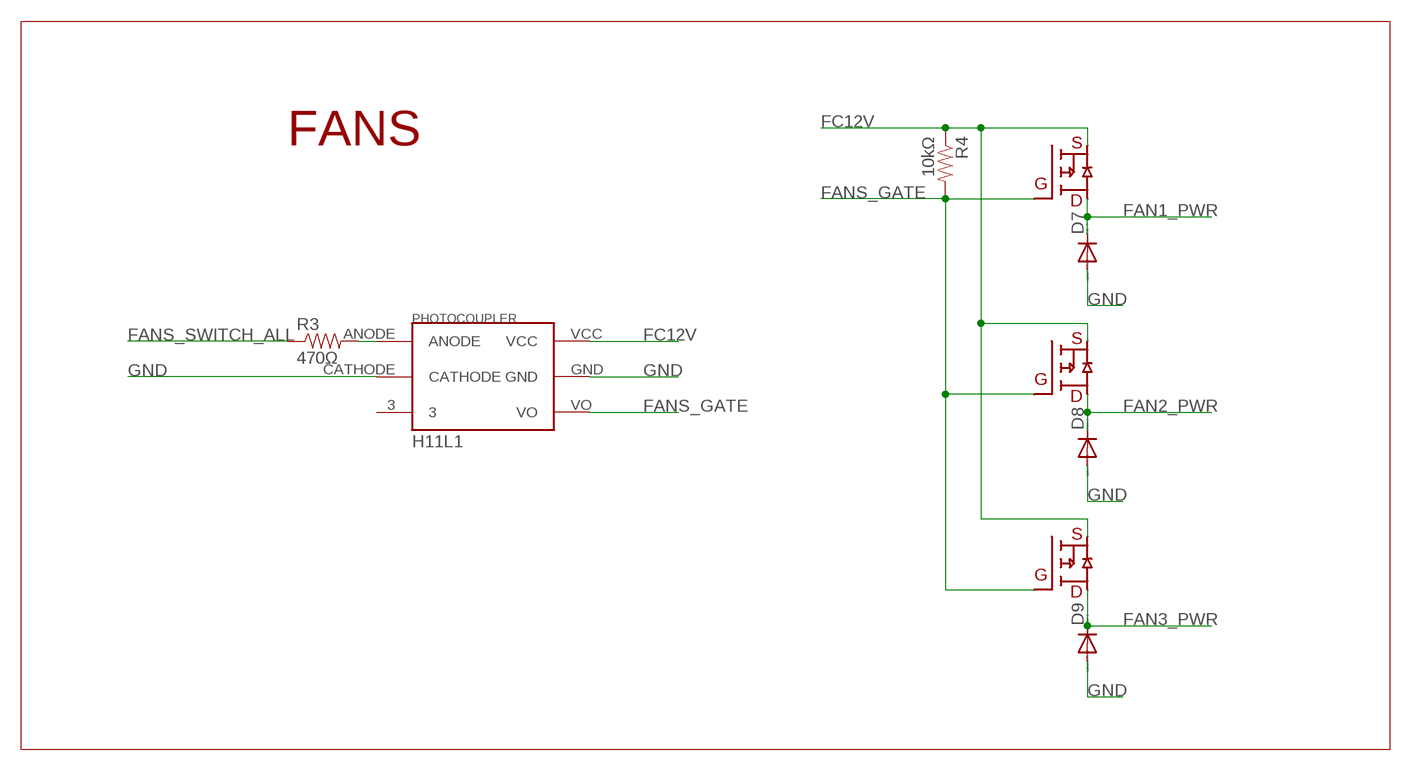
[diagram p8: schematic, sheet 8]

### Parts
D7  DIODE-DO214AC  [DO214AC]
D8  DIODE-DO214AC  [DO214AC]
D9  DIODE-DO214AC  [DO214AC]
R3  470Ω  RESISTOR0805-RES  [0805]
R4  10kΩ  RESISTOR0805-RES  [0805]
U$4  H11L1H11L1  [H11L1]
U$7  DMP3056L-7DMP3056L-7  [DMP3056L-7]
U$8  DMP3056L-7DMP3056L-7  [DMP3056L-7]
U$9  DMP3056L-7DMP3056L-7  [DMP3056L-7]

### Nets
FAN1_PWR: D7.C U$7.D(DRAIN) ; also sheet 2
FAN2_PWR: D8.C U$8.D(DRAIN) ; also sheet 2
FAN3_PWR: D9.C U$9.D(DRAIN) ; also sheet 2
FANS_GATE: R4.2 U$4.VO U$7.G(GATE) U$8.G(GATE) U$9.G(GATE)
FANS_SWITCH_ALL: R3.1 ; also sheet 1
FC12V: R4.1 U$4.VCC U$7.S(SOURCE) U$8.S(SOURCE) U$9.S(SOURCE) ; also sheet 1,3,6,7
GND: D7.A D8.A D9.A U$4.CATHODE U$4.GND ; also sheet 1,2,3,4,5,6,7,9
N$12: R3.2 U$4.ANODE
Unconnected: U$4.3

### Notes on the sheet
- FANS

## Sheet 9 of 9: FC LP FILTER
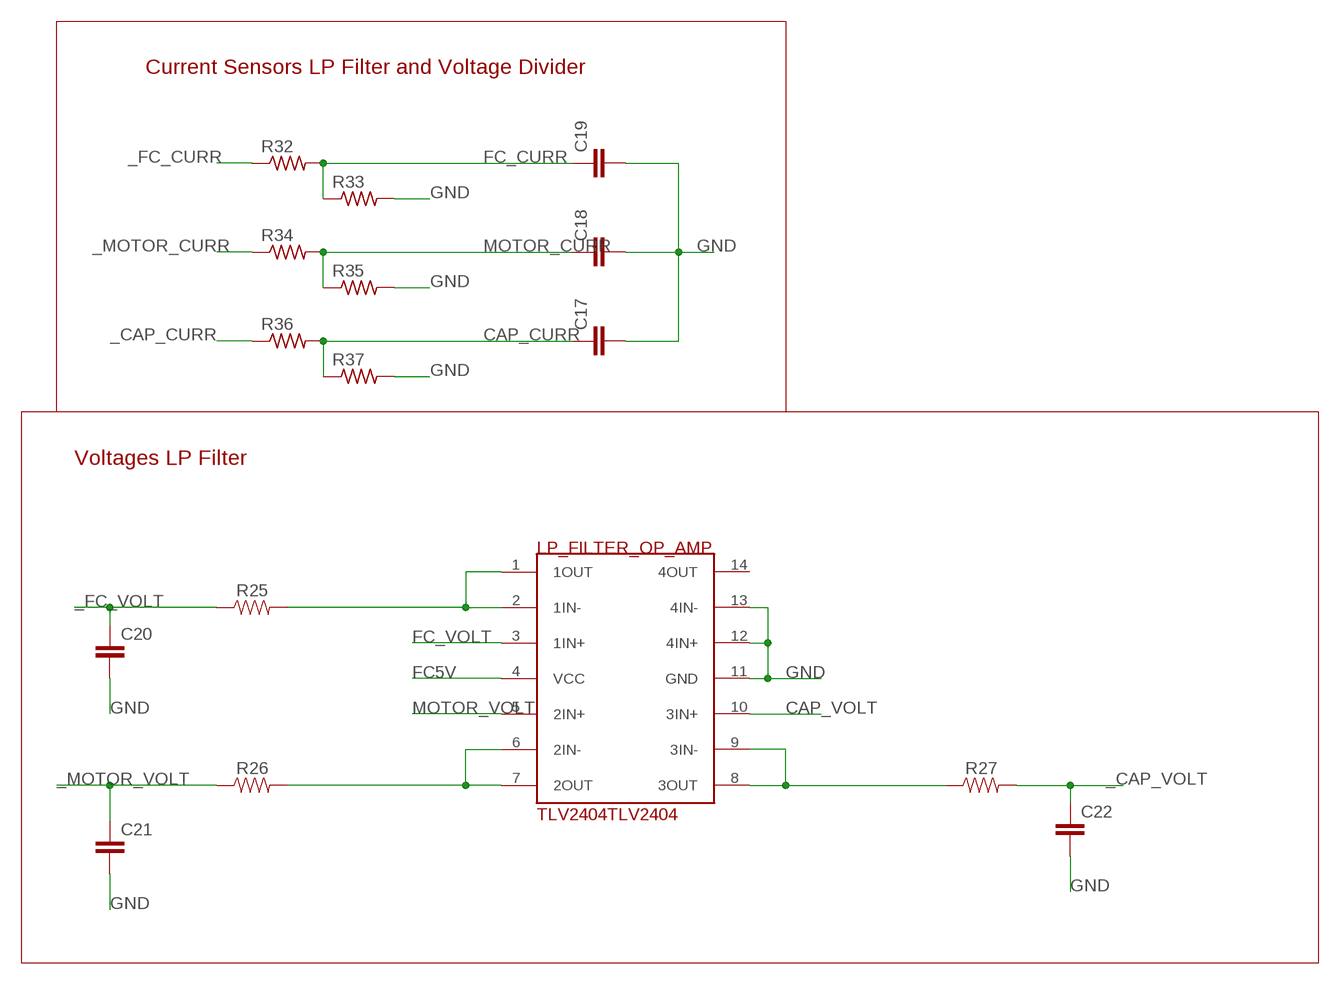
[diagram p9: schematic, sheet 9]

### Parts
C17  CAP0805  [0805]
C18  CAP0805  [0805]
C19  CAP0805  [0805]
C20  CAP0805  [0805]
C21  CAP0805  [0805]
C22  CAP0805  [0805]
LP_FILTER_OP_AMP  TLV2404TLV2404  [DIL14]
R25  RESISTOR0402  [0402]
R26  RESISTOR0402  [0402]
R27  RESISTOR0402  [0402]
R32  R-US_R0805  [R0805]
R33  R-US_R0805  [R0805]
R34  R-US_R0805  [R0805]
R35  R-US_R0805  [R0805]
R36  R-US_R0805  [R0805]
R37  R-US_R0805  [R0805]

### Nets
_CAP_CURR: R36.1 ; also sheet 5
_CAP_VOLT: C22.1 R27.2 ; also sheet 1
_FC_CURR: R32.1 ; also sheet 5
_FC_VOLT: C20.1 R25.1 ; also sheet 1
_MOTOR_CURR: R34.1 ; also sheet 5
_MOTOR_VOLT: C21.1 R26.1 ; also sheet 1
CAP_CURR: C17.1 R36.2 R37.1 ; also sheet 1
CAP_VOLT: LP_FILTER_OP_AMP.10(3IN+) ; also sheet 5
FC5V: LP_FILTER_OP_AMP.4(VCC) ; also sheet 1,6
FC_CURR: C19.1 R32.2 R33.1 ; also sheet 1
FC_VOLT: LP_FILTER_OP_AMP.3(1IN+) ; also sheet 5
GND: C17.2 C18.2 C19.2 C20.2 C21.2 C22.2 LP_FILTER_OP_AMP.11(GND) LP_FILTER_OP_AMP.12(4IN+) LP_FILTER_OP_AMP.13(4IN-) R33.2 R35.2 R37.2 ; also sheet 1,2,3,4,5,6,7,8
MOTOR_CURR: C18.1 R34.2 R35.1 ; also sheet 1
MOTOR_VOLT: LP_FILTER_OP_AMP.5(2IN+) ; also sheet 5
N$24: LP_FILTER_OP_AMP.1(1OUT) LP_FILTER_OP_AMP.2(1IN-) R25.2
N$26: LP_FILTER_OP_AMP.6(2IN-) LP_FILTER_OP_AMP.7(2OUT) R26.2
N$27: LP_FILTER_OP_AMP.8(3OUT) LP_FILTER_OP_AMP.9(3IN-) R27.1
Unconnected: LP_FILTER_OP_AMP.14(4OUT)

### Notes on the sheet
- Current Sensors LP Filter and Voltage Divider
- Voltages LP Filter

## Library data of the parts
AUX5VLED AUX12VLED FC5VLED FC12VLED = led:LED: LED OSRAM: - CHIPLED LG R971, LG N971, LY N971, LG Q971, LY Q971, LO R971, LY R971 LH N974, LH R974 LS Q976, LO Q976, LY Q976 LO Q996 - Hyper CHIPLED LW Q18S LB Q993, LB Q99A, LB R99A - SideLED LS A670, LO A670, LY A670, LG A670, LP A670 LB A673, LV A673, LT A673, LW A673 LH A674 LY A675 LS A676, LA A676, LO A676, LY A676, LW A676 LS A679, LY A679, LG A679 - Hyper Micro SIDELED® LS Y876, LA Y876, LO Y876, LY Y876 LT Y87S - SmartLED LW L88C, LW L88S LB L89C, LB L89S, LG L890 LS L89K, LO L89K, LY L89K LS L896, LA L896, LO L896, LY L896 - TOPLED LS T670, LO T670, LY T670, LG T670, LP T670 LSG T670, LSP T670, LSY T670, LOP T670, LYG T670 LG T671, LOG T671, LSG T671 LB T673, LV T673, LT T673, LW T673 LH T674 LS T676, LA T676, LO T676, LY T676, LB T676, LH T676, LSB T676, LW T676 LB T67C, LV T67C, LT T67C, LS T67K, LO T67K, LY T67K, LW E67C LS E67B, LA E67B, LO E67B, LY E67B, LB E67C, LV E67C, LT E67C LW T67C LS T679, LY T679, LG T679 LS T770, LO T770, LY T770, LG T770, LP T770 LB T773, LV T773, LT T773, LW T773 LH T774 LS E675, LA E675, LY E675, LS T675 LS T776, LA T776, LO T776, LY T776, LB T776 LHGB T686 LT T68C, LB T68C - Hyper Mini TOPLED® LB M676 - Mini TOPLED Santana® LG M470 LS M47K, LO M47K, LY M47K Source: http://www.osram.convergy.de LUXEON: - LUMILED® LXK2-PW12-R00, LXK2-PW12-S00, LXK2-PW14-U00, LXK2-PW14-V00 LXK2-PM12-R00, LXK2-PM12-S00, LXK2-PM14-U00 LXK2-PE12-Q00, LXK2-PE12-R00, LXK2-PE12-S00, LXK2-PE14-T00, LXK2-PE14-U00 LXK2-PB12-K00, LXK2-PB12-L00, LXK2-PB12-M00, LXK2-PB14-N00, LXK2-PB14-P00, LXK2-PB14-Q00 LXK2-PR12-L00, LXK2-PR12-M00, LXK2-PR14-Q00, LXK2-PR14-R00 LXK2-PD12-Q00, LXK2-PD12-R00, LXK2-PD12-S00 LXK2-PH12-R00, LXK2-PH12-S00 LXK2-PL12-P00, LXK2-PL12-Q00, LXK2-PL12-R00 Source: www.luxeon.com KINGBRIGHT: KA-3528ASYC Source: www.kingbright.com
AUX_PWR FC_PWR = EcoCar-Connectors:TE_6-PIN: 6 Pin TE Mini-Universal MATE-N-LOK Part Number: 1-770969-0 Digikey Part Number: A32475-ND Matching Plug: A97674-ND Matching Crimps: A100828CT-ND
C1-C5 C14 C15 C27 = SparkFun-Passives:CAP: Capacitor Standard 0603 ceramic capacitor, and 0.1" leaded capacitor.
C6-C13 C16-C26 = SparkFun-Capacitors:CAP: Capacitor Standard 0603 ceramic capacitor, and 0.1" leaded capacitor.
D1 D2 = SparkFun-LED:LED: LED (Generic) Standard schematic elements and footprints for 5mm, 3mm, 1206, and 0603 sized LEDs. Generic LEDs with no color specified.
D3-D9 = diode:DIODE-: DIODE
FANS_1 FANS_2 H2_SENSOR PRESSURE RELAYBOARD1 RELAYBOARD2 START TEMPERATURE VALVES = ETHERNET:ETHERNET: Ethernet port with 2 leds. digikey number A122645-ND
H1-H8 = holes:MOUNT-PAD-ROUND: MOUNTING PAD, round
J1 = FCC_parts:BLUETOOTH
J2 = SparkFun-Connectors:CONN_05: Multi connection point. Often used as Generic Header-pin footprint for 0.1 inch spaced/style header connections On any of the 0.1 inch spaced packages, you can populate with these: Break Away Headers - Straight <https://www.sparkfun.com/products/116> (PRT-00116) Break Away Male Headers - Right Angle <https://www.sparkfun.com/products/553> (PRT-00553) Female Headers <https://www.sparkfun.com/products/115> (PRT-00115) Break Away Headers - Machine Pin <https://www.sparkfun.com/products/117> (PRT-00117) Break Away Female Headers - Swiss Machine Pin <https://www.sparkfun.com/products/743> (PRT-00743) For SCREWTERMINALS and SPRING TERMINALS visit here: Screw Terimnals on SparkFun.com <https://www.sparkfun.com/search/results?term=Screw+Terminals> (5mm/3.5mm/2.54mm spacing) This device is also useful as a general connection point to wire up your design to another part of your project. Our various solder wires solder well into these plated through hole pads. Hook-Up Wire - Assortment (Stranded, 22 AWG) <https://www.sparkfun.com/products/11375> (PRT-11375) Hook-Up Wire - Assortment (Solid Core, 22 AWG) <https://www.sparkfun.com/products/11367> (PRT-11367) View the entire wire category on our website here <https://www.sparkfun.com/categories/141> Special notes: Molex polarized connector foot print use with SKU : PRT-08231 with associated crimp pins and housings. 1MM SMD Version SKU: PRT-10208; PROD_ID: Combine 8288+8399
JP1 = jumper:JP2E: JUMPER
JP2 = jumper:JP4Q: JUMPER
JP3-JP6 = jumper:JP1E: JUMPER
LP_FILTER_OP_AMP = FCC_parts:TLV2404
Q1 = n-mos switch:MOSFET-NCH; PROD_ID: TRANS-12988
R1-R21 R24 R38-R61 = SparkFun-Passives:RESISTOR: Resistor Basic schematic elements and footprints for 0603, 1206, and PTH resistors.
R25-R27 = SparkFun-Resistors:RESISTOR: Generic Resistor Package
R28-R37 = resistor:R-US_: RESISTOR, American symbol
SHTSENSOR = FCC_parts:SHT31-DIS
U1 = SparkFun-DigitalIC:MAX232: RS232 Transceiver Very common IC. This is generically called 'MAX232', but works with the 3V equivalent MAX3232 generic ICs. Field tested and mother approved. Spark Fun Electronics SKU : COM-00316 (DIP) and COM-00589 (SMD)
U$1 = FCC_parts:NUCLEO-F746ZG
U$2 = openlog:OPENLOG
U$3 U$5 = FCC_parts:SN74LVC245AN
U$4 U$6 U$11 U$14 U$16 = FCC_parts:H11L1
U$7-U$9 U$12 U$13 U$15 U$17 = FCC_parts:DMP3056L-7
U$10 = FCC_parts:UMFT234XF
U$18 = DS3231:DS3231
U$19 = FCC_parts:ADS1015
U$20 = 3_3V TVS:CD143A-SR3.3CT-ND
U$21 U$31 = 5V TVS:641-1198-1-ND
U$22 = 12V TVS:P6KE15A-E3/54GICT-ND
U$25 = FCC_parts:5060BRG4
U$26 = EG4621CT-ND:EG4621CT-ND: surface mount push putton digikey number EG4621CT-ND
U$27-U$29 U$32 = 100uF_Cap:CAP-VS-SERIES-PACKAGE-E(ELECT)
U$30 = FCC_parts:ADAFRUITOLED
X2 = con-subd:F09: SUB-D; OC_FARNELL: unknown; OC_NEWARK: unknown